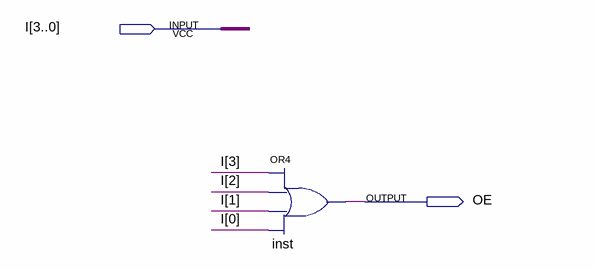
[diagram p0: schematic sheet]
// Quartus schematic OE_select.bdf as structural Verilog: 1 symbols, 2 pins
module OE_select (
  input  [3:0] I,
  output OE
);

  or inst (OE, I[3], I[2], I[1], I[0]);
endmodule
